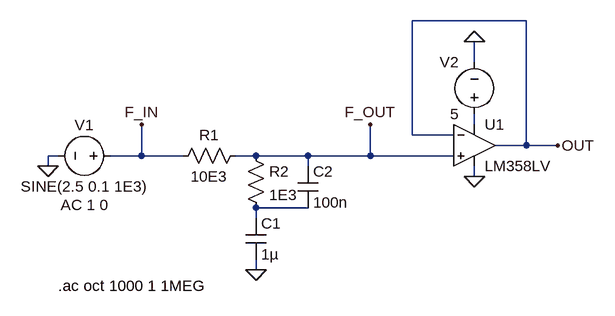
[diagram p0: schematic 2orderLPF.asc]
2orderLPF.asc, the LTspice schematic file:
Version 4
SHEET 1 880 680
WIRE 656 -96 480 -96
WIRE 576 -32 576 -64
WIRE 576 64 576 48
WIRE 480 80 480 -96
WIRE 544 80 480 80
WIRE 656 96 656 -96
WIRE 656 96 608 96
WIRE 704 96 656 96
WIRE -64 112 -80 112
WIRE 64 112 64 64
WIRE 64 112 16 112
WIRE 128 112 64 112
WIRE 240 112 208 112
WIRE 320 112 240 112
WIRE 416 112 416 64
WIRE 416 112 320 112
WIRE 544 112 416 112
WIRE -80 128 -80 112
WIRE 320 128 320 112
WIRE 576 144 576 128
WIRE 320 192 240 192
WIRE 240 208 240 192
WIRE 240 288 240 272
FLAG 240 288 0
FLAG 576 144 0
FLAG 576 -64 0
FLAG 704 96 OUT
FLAG -80 128 0
FLAG 416 64 F_OUT
FLAG 64 64 F_IN
SYMBOL cap 224 208 R0
SYMATTR InstName C1
SYMATTR Value 1µ
SYMBOL res 224 96 R90
WINDOW 0 0 56 VBottom 2
WINDOW 3 32 56 VTop 2
SYMATTR InstName R1
SYMATTR Value 10E3
SYMBOL ZZZ\\OpAmp\\LM358LV 576 32 R0
SYMATTR InstName U1
SYMBOL voltage 576 64 R180
WINDOW 0 24 96 Left 2
WINDOW 3 24 16 Left 2
WINDOW 123 0 0 Left 0
WINDOW 39 0 0 Left 0
SYMATTR InstName V2
SYMATTR Value 5
SYMBOL voltage 32 112 R90
WINDOW 0 -32 56 VBottom 2
WINDOW 3 32 56 VTop 2
WINDOW 123 60 56 VTop 2
WINDOW 39 0 0 Left 0
SYMATTR InstName V1
SYMATTR Value SINE(2.5 0.1 1E3)
SYMATTR Value2 AC 1 0
SYMBOL res 224 96 R0
SYMATTR InstName R2
SYMATTR Value 1E3
SYMBOL cap 304 128 R0
SYMATTR InstName C2
SYMATTR Value 100n
TEXT -64 312 Left 2 !.ac oct 1000 1 1MEG

The netlist it stands for:
* 2orderLPF.asc
C1 N002 0 1µ
R1 F_OUT F_IN 10E3
* U1: LM358LV (symbol ZZZ\OpAmp\LM358LV not available, pins judged from their places): In+=F_OUT In-=OUT V+=N001 V-=0 OUT=OUT
V2 N001 0 5
V1 F_IN 0 SINE(2.5 0.1 1E3) AC 1 0
R2 F_OUT N002 1E3
C2 F_OUT N002 100n
.ac oct 1000 1 1MEG
.backanno
.end